# Altium schematic sheet Communication.SchDoc: Communication
size A4
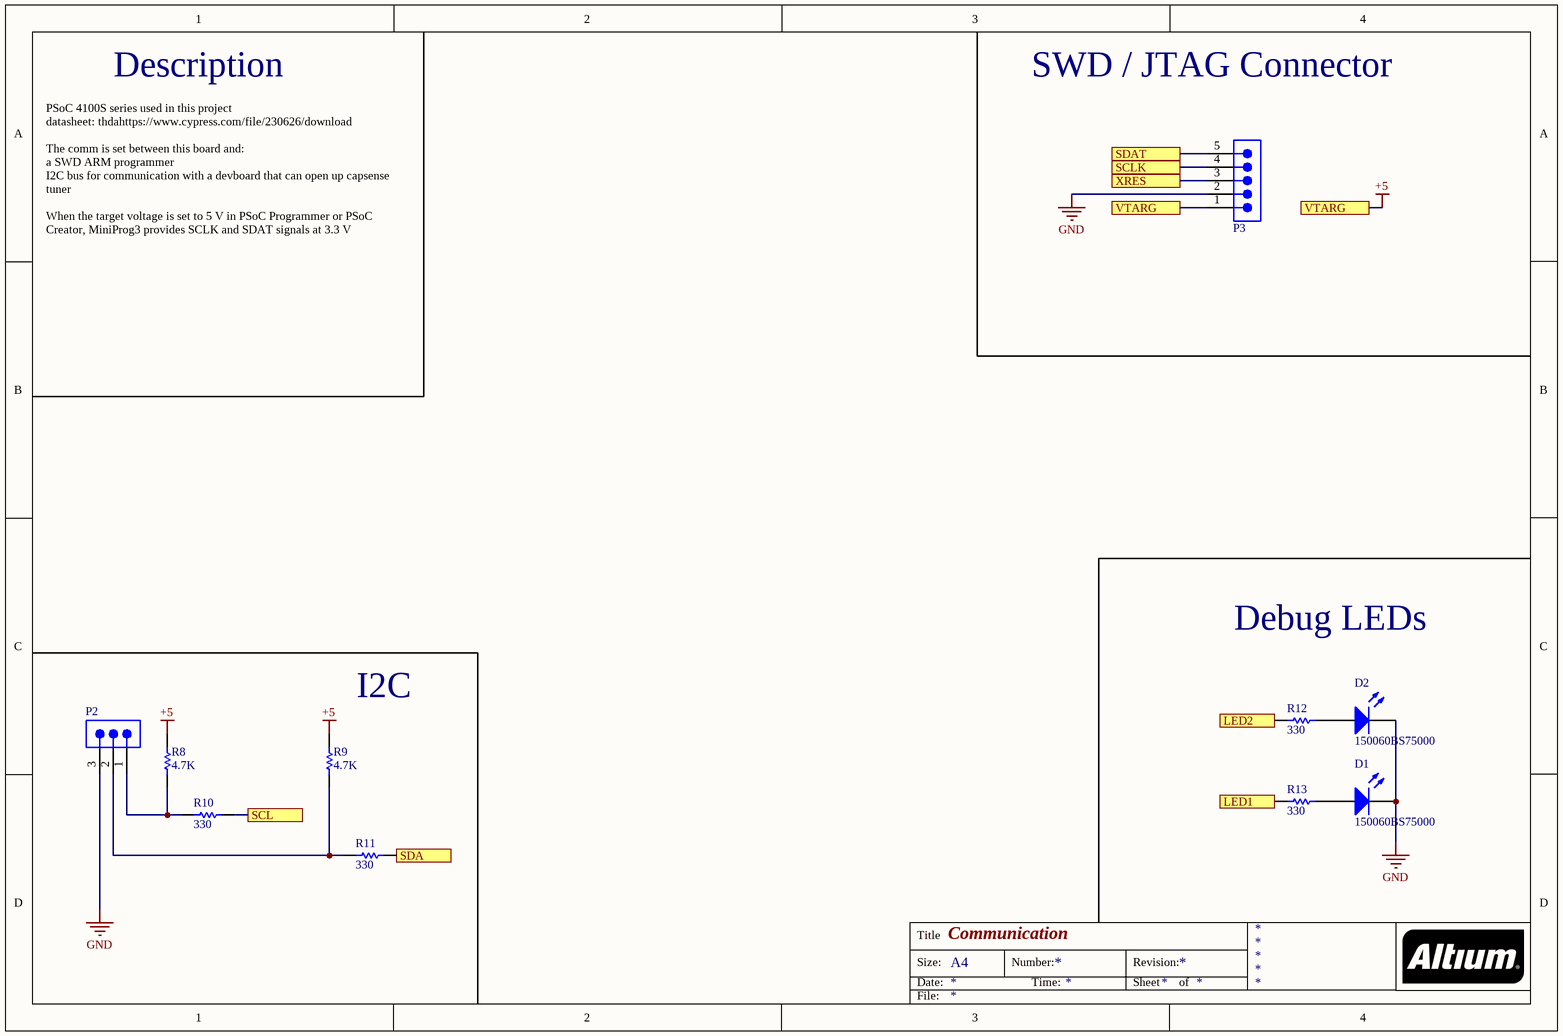
[diagram p0: Communication.SchDoc]

## Parts
D1  150060BS75000  [0603_A]
D2  150060BS75000  [0603_A]
P2  TSW-103-07-F-S  [SMTC-TSW-103-07-X-S]  (value not drawn)
P3  MTLW-105-05-L-S-190  [SMTC-MTLW-105-05-X-S-190]  (value not drawn)
R8  4.7K  [RESC1608X55X25ML10T15]
R9  4.7K  [RESC1608X55X25ML10T15]
R10  330  [RESC0603(1608)_L]
R11  330  [RESC0603(1608)_L]
R12  330  [RESC0603(1608)_L]
R13  330  [RESC0603(1608)_L]

## Ports
LED1 (in), LED2 (in), SCL, SCLK, SDA, SDAT, VTARG, XRES

## Nets
+5: P3.1 R8.2 R9.2 ; port VTARG
GND: D1.1(K) D2.1(K) P2.3 P3.2
LED1: R13.1 ; port LED1
LED2: R12.1 ; port LED2
SCL: R10.2 ; port SCL
SCLK: P3.4 ; port SCLK
SDA: R11.2 ; port SDA
SDAT: P3.5 ; port SDAT
XRES: P3.3 ; port XRES
NetD1_2: D1.2(A) R13.2
NetD2_2: D2.2(A) R12.2
NetP2_1: P2.1 R8.1 R10.1
NetP2_2: P2.2 R9.1 R11.1

## Notes on the sheet
- Description
- SWD / JTAG Connector
- PSoC 4100S series used in this project
  datasheet: thdahttps://www.cypress.com/file/230626/download
  The comm is set between this board and:
  a SWD ARM programmer
  I2C bus for communication with a devboard that can open up capsense tuner
  When the target voltage is set to 5 V in PSoC Programmer or PSoC Creator, MiniProg3 provides SCLK and SDAT signals at 3.3 V
- Debug LEDs
- (near R9) I2C
- Title
- Size:
- Date:
- A4
- Number:
- Time:
- Revision:
- Sheet
- of
- File:

## Library data of the parts
D1 D2 = CMP-1426-00003-1: SMD mono-color Chip LED, WL-SMCW, Blue; Manufacturer: Wuerth Elektronik; Color: Blue; ComponentLink2Description: Datasheet; ComponentLink2URL: http://katalog.we-online.com/led/datasheet/150060BS75000.pdf; ComponentLink1URL: http://www.we-online.com; PackageReference: 0603_A; PartNumber: 150060BS75000; ComponentLink1Description: Manufacturer URL
P2 = CMP-1024-00331-1: 0.025" SQ Post Header, Through-hole, Vertical, -55 to 125 degC, 2.54 mm Pitch, 3-Pin, Male, RoHS; Manufacturer: Samtec; Pitch: 2.54 mm; DatasheetVersion: F-214; ComponentLink1Description: Manufacturer URL; ComponentLink3URL: http://www.samtec.com/documents/webfiles/cpdf/TSW-XXX-XX-XXX-X-XX-XXX-MKT.pdf; Mounting Technology: Through-hole; PackageDescription: .025[0.64] SQ. Post Terminal Strip Assembly; Temperature Range: -55 to 125 degC; ComponentLink3Description: Package Specification; Orientation: Vertical; PartNumber: TSW-103-07-F-S; RoHS: True; PackageVersion: DM, 8/1988; ComponentLink2Description: Datasheet; ComponentLink1URL: http://www.samtec.com; ComponentLink2URL: http://www.samtec.com/documents/webfiles/pdf/TSW_TH.PDF; PackageReference: TSW-103-07-X-S
P3 = CMP-1024-00079-1: Low Profile .025" SQ Post Header, Through-hole, Vertical, -55 to 125 degC, 2.54 mm Pitch, 5-Pin, Male, RoHS; Manufacturer: Samtec; Pitch: 2.54 mm; Mounting Technology: Through-hole; ComponentLink2Description: Datasheet; DatasheetVersion: F-214; Temperature Range: -55 to 125 degC; ComponentLink1Description: Manufacturer URL; Orientation: Vertical; ComponentLink2URL: http://www.samtec.com/documents/webfiles/pdf/MTLW_TH.PDF; PackageDescription: Low Profile Terminal Assembly; PackageVersion: T, 6/1991; RoHS: True; ComponentLink3Description: Package Specification; ComponentLink1URL: http://www.samtec.com; PackageReference: MTLW-105-05-X-S-190; ComponentLink3URL: http://www.samtec.com/documents/webfiles/cpdf/MTLW-1XX-XX-XX-X-XXX-XX-XX-MKT1.pdf; PartNumber: MTLW-105-05-L-S-190
R8 R9 = CMP-2000-05024-1: RC0603JR-074K7L Chip Resistor, 4.7 KOhm, +/- 5%, 100 mW, -55 to 155 degC, 0603 (1608 Metric), RoHS, Tape and Reel; Manufacturer: Yageo; Resistance: 4.7kOhms; Temperature Coefficient: 100PPM/C; Power Rating: 100mW; Voltage Rating: 50V; Operating Temperature Range: -55Cto+155C; Case Code - mm: 1608; Tolerance: 5%; Product: ThickFilmResistorsGeneralPurpose; Case Code - in: 0603; Datasheet URL: http://www.yageo.com/documents/recent/PYu-RC_Group_51_RoHS_L_04.pdf; Package Reference: 603; Datasheet Version: Rev. 4, 02/2016; Package Description: 2-Pin Surface Mount Device, Body 1.6 x 0.8 mm; Manufacturer URL: http://www.yageo.com/; Series: RC; Packaging: Reel; Termination Style: SMD/SMT
R10-R13 = CMP-1012-00062-1: 330R 0.1W 5% 0603 (1608 Metric)  SMD; Value: 330.00 Ohm; Case-EIA: 0603; Case-Metric: 1608; Tolerance: 5 %; Power: 0.1 W; Technology: SMT